# EAGLE schematic Module_20200402_1_FlexSensorAdapter (EAGLE 9.3.2)
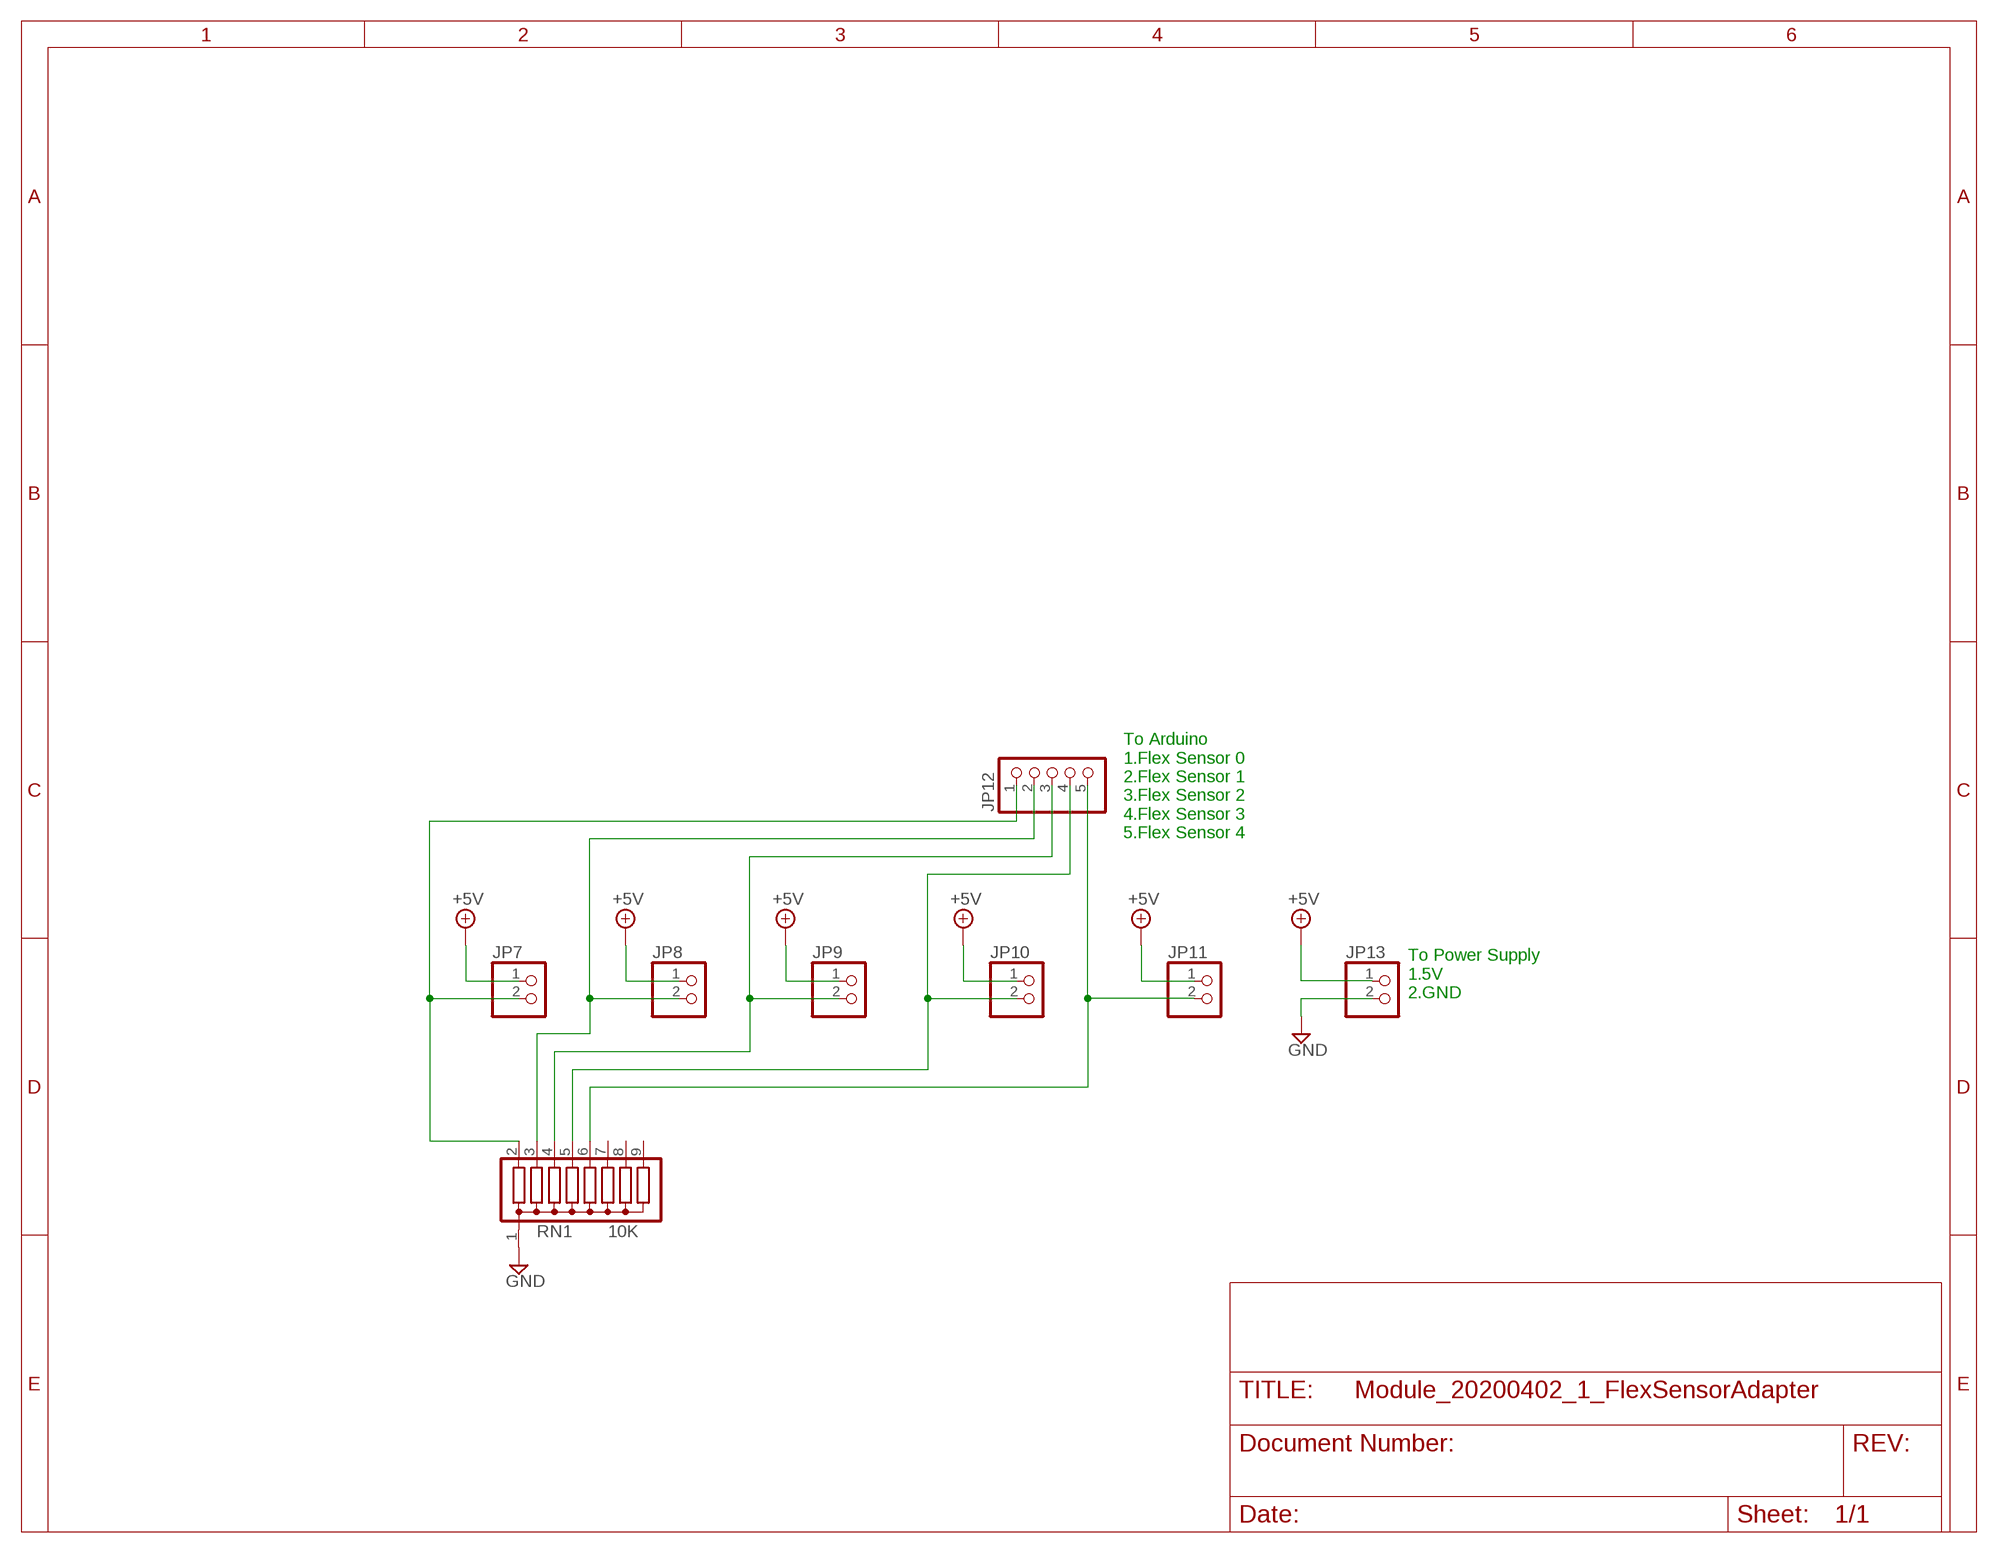
[diagram p0: schematic, sheet 1]

## Parts
JP7  PINHD-1X2  [1X02]
JP8  PINHD-1X2  [1X02]
JP9  PINHD-1X2  [1X02]
JP10  PINHD-1X2  [1X02]
JP11  PINHD-1X2  [1X02]
JP12  PINHD-1X5  [1X05]
JP13  PINHD-1X2  [1X02]
RN1  10K  G08R  [SIL9]

## Nets
+5V: JP7.1 JP8.1 JP9.1 JP10.1 JP11.1 JP13.1
GND: JP13.2 RN1.1
N$6: JP7.2 JP12.1 RN1.2
N$7: JP8.2 JP12.2 RN1.3
N$8: JP9.2 JP12.3 RN1.4
N$9: JP10.2 JP12.4 RN1.5
N$10: JP11.2 JP12.5 RN1.6
Unconnected: RN1.7 RN1.8 RN1.9

## Notes on the sheet
- To Arduino
  1.Flex Sensor 0
  2.Flex Sensor 1
  3.Flex Sensor 2
  4.Flex Sensor 3
  5.Flex Sensor 4
- To Power Supply
  1.5V
  2.GND

## Library data of the parts
JP7-JP11 JP13 = pinhead:PINHD-1X2: PIN HEADER
JP12 = pinhead:PINHD-1X5: PIN HEADER
RN1 = resistor-sil:G08R: SIL RESISTOR; OC_FARNELL: unknown; OC_NEWARK: unknown